# Altium schematic sheet adc.schdoc: SoRad: Analog to Digital Conversion
size A3; Author: Chris Hiszpanski
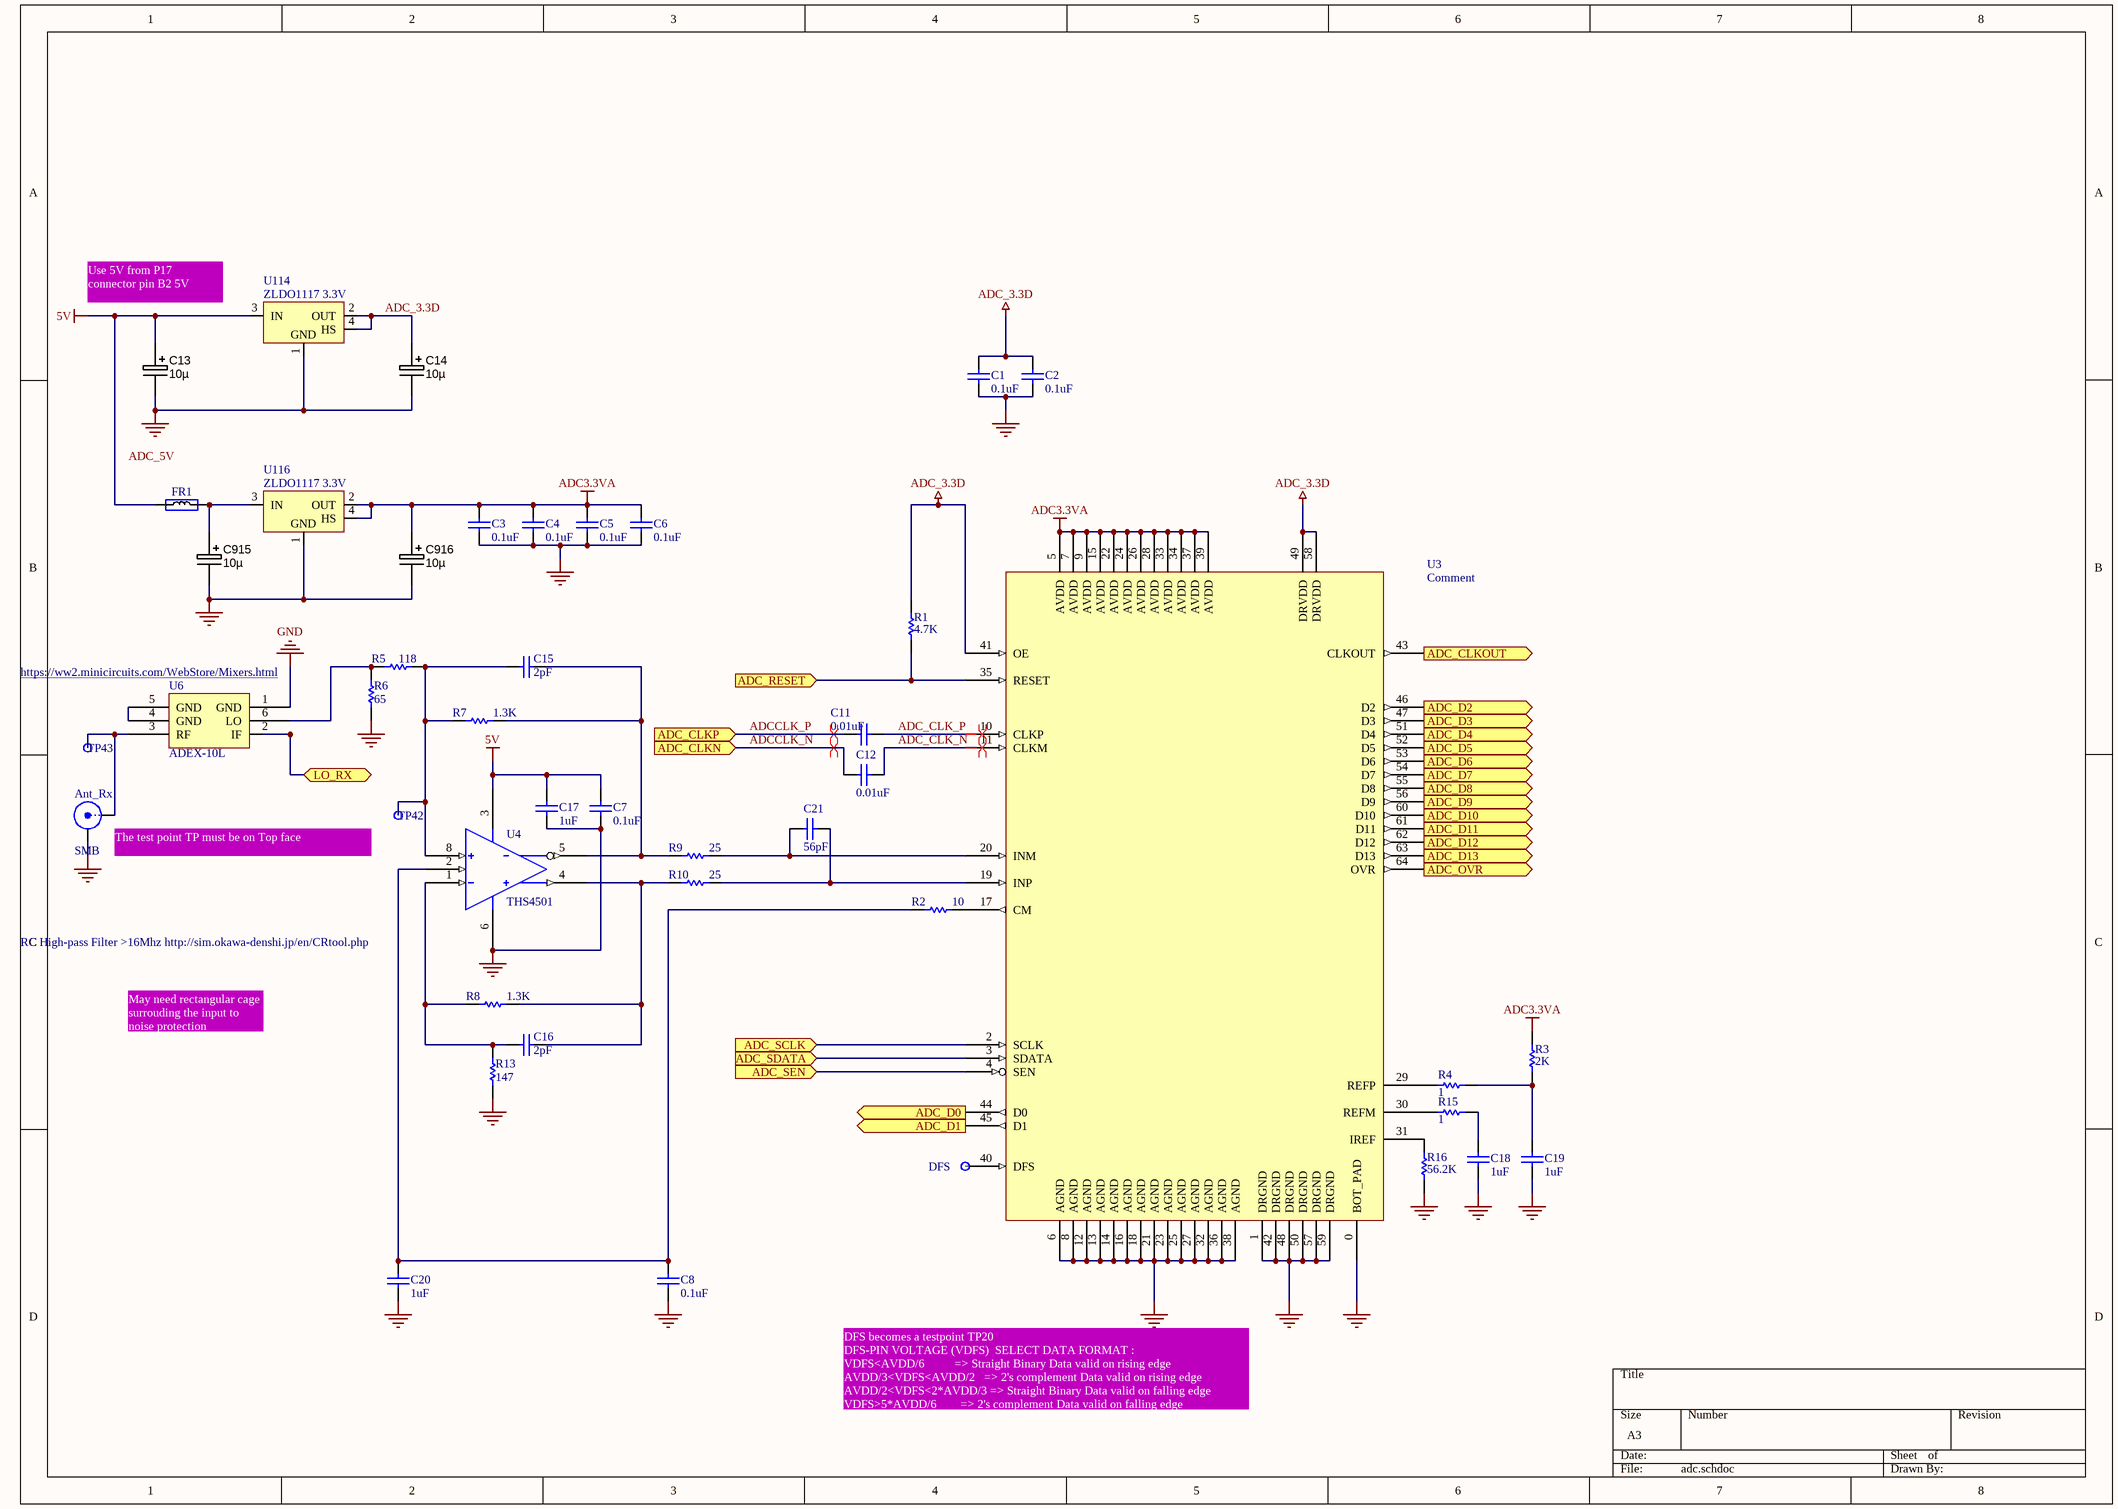
[diagram p0: adc.schdoc]

## Parts
Ant_Rx  SMB  [SMB_V-RJ45]
C1  0.1uF  [CAPC1005X55N]
C2  0.1uF  [CAPC1005X55N]
C3  0.1uF  [CAPC1005X55N]
C4  0.1uF  [CAPC1005X55N]
C5  0.1uF  [CAPC1005X55N]
C6  0.1uF  [CAPC1005X55N]
C7  0.1uF  [CAPC1005X55N]
C8  0.1uF  [CAPC1005X55N]
C11  0.01uF  [CAPC1005X55N]
C12  0.01uF  [CAPC1005X55N]
C13  value 10µ  [CAPMP6032X280N]  (hidden comment: approved sub OK)
C14  value 10µ  [CAPMP6032X280N]  (hidden comment: approved sub OK)
C15  2pF  [CAPC1005X55N]
C16  2pF  [CAPC1005X55N]
C17  1uF  [CAPC1005X55N]
C18  1uF  [CAPC1005X55N]
C19  1uF  [CAPC1005X55N]
C20  1uF  [CAPC1005X55N]
C21  56pF  [CAPC1005X55N]
C915  value 10µ  [CAPMP6032X280N]  (hidden comment: approved sub OK)
C916  value 10µ  [CAPMP6032X280N]  (hidden comment: approved sub OK)
DFS  P2V5  [TPS127]  (value not drawn)
FR1  Ferrite  [C0603]  (value not drawn)
R1  4.7K  [RESC1005N]
R2  10  [RESC1005N]
R3  2K  [RESC1005N]
R4  1  [RESC1005N]
R5  118  [RESC1005N]
R6  65  [RESC1005N]
R7  1.3K  [RESC1005N]
R8  1.3K  [RESC1005N]
R9  25  [RESC1005N]
R10  25  [RESC1005N]
R13  147  [RESC1005N]
R15  1  [RESC1005N]
R16  56.2K  [RESC1005N]
TP42  LO_RX  [TPS127]  (value not drawn)
TP43  LO_RX  [TPS127]  (value not drawn)
U3  Comment  [HQFP64]
U4  THS4501  [SOIC8]
U6  ADEX-10L
U114  ZLDO1117 3.3V  [SOT223]
U116  ZLDO1117 3.3V  [SOT223]

## Ports
ADC_CLKN (in), ADC_CLKOUT (out), ADC_CLKP (in), ADC_D0 (out), ADC_D1 (out), ADC_D2 (out), ADC_D3 (out), ADC_D4 (out), ADC_D5 (out), ADC_D6 (out), ADC_D7 (out), ADC_D8 (out), ADC_D9 (out), ADC_D10 (out), ADC_D11 (out), ADC_D12 (out), ADC_D13 (out), ADC_OVR (out), ADC_RESET (in), ADC_SCLK (in), ADC_SDATA (in), ADC_SEN (in), LO_RX

## Nets
5V: C7.2 C13.1 C17.2 FR1.1 U4.3(Vs+) U114.3(IN)
ADC3.3VA: C3.2 C4.2 C5.2 C6.2 C916.1 R3.1 U3.5(AVDD) U3.7(AVDD) U3.9(AVDD) U3.15(AVDD) U3.22(AVDD) U3.24(AVDD) U3.26(AVDD) U3.28(AVDD) U3.33(AVDD) U3.34(AVDD) U3.37(AVDD) U3.39(AVDD) U116.2(OUT) U116.4(HS)
ADC_3.3D: C1.2 C2.2 C14.1 R1.2 U3.41(OE) U3.49(DRVDD) U3.58(DRVDD) U114.2(OUT) U114.4(HS)
GND: Ant_Rx.2(Y) C1.1 C2.1 C3.1 C4.1 C5.1 C6.1 C7.1 C8.1 C13.2 C14.2 C17.1 C18.1 C19.1 C20.1 C915.2 C916.2 R6.2 R13.2 R16.2 U3.0(BOT_PAD) U3.1(DRGND) U3.6(AGND) U3.8(AGND) U3.12(AGND) U3.13(AGND) U3.14(AGND) U3.16(AGND) U3.18(AGND) U3.21(AGND) U3.23(AGND) U3.25(AGND) U3.27(AGND) U3.32(AGND) U3.36(AGND) U3.38(AGND) U3.42(DRGND) U3.48(DRGND) U3.50(DRGND) U3.57(DRGND) U3.59(DRGND) U4.6(Vs-) U6.1(GND) U114.1(GND) U116.1(GND)
ADC_CLK_N: C12.2 U3.11(CLKM)
ADC_CLK_P: C11.1 U3.10(CLKP)
ADC_CLKOUT: U3.43(CLKOUT) ; port ADC_CLKOUT
ADC_D0: U3.44(D0) ; port ADC_D0
ADC_D1: U3.45(D1) ; port ADC_D1
ADC_D2: U3.46(D2) ; port ADC_D2
ADC_D3: U3.47(D3) ; port ADC_D3
ADC_D4: U3.51(D4) ; port ADC_D4
ADC_D5: U3.52(D5) ; port ADC_D5
ADC_D6: U3.53(D6) ; port ADC_D6
ADC_D7: U3.54(D7) ; port ADC_D7
ADC_D8: U3.55(D8) ; port ADC_D8
ADC_D9: U3.56(D9) ; port ADC_D9
ADC_D10: U3.60(D10) ; port ADC_D10
ADC_D11: U3.61(D11) ; port ADC_D11
ADC_D12: U3.62(D12) ; port ADC_D12
ADC_D13: U3.63(D13) ; port ADC_D13
ADC_OVR: U3.64(OVR) ; port ADC_OVR
ADC_RESET: R1.1 U3.35(RESET) ; port ADC_RESET
ADC_SCLK: U3.2(SCLK) ; port ADC_SCLK
ADC_SDATA: U3.3(SDATA) ; port ADC_SDATA
ADC_SEN: U3.4(SEN) ; port ADC_SEN
ADCCLK_N: C12.1 ; port ADC_CLKN
ADCCLK_P: C11.2 ; port ADC_CLKP
LO_RX: U6.2(IF) ; port LO_RX
NetAnt_Rx_1: Ant_Rx.1(X) TP43.1 U6.3(RF)
NetC8_2: C8.2 C20.2 R2.2 U4.2(Vocm)
NetC15_1: C15.1 R7.1 R9.2 U4.5(Vout-)
NetC15_2: C15.2 R5.1 R7.2 TP42.1 U4.8(Vin+)
NetC16_1: C16.1 R8.1 R10.2 U4.4(Vout+)
NetC16_2: C16.2 R8.2 R13.1 U4.1(Vin-)
NetC18_2: C18.2 R15.2
NetC19_2: C19.2 R3.2 R4.2
NetC21_1: C21.1 R9.1 U3.20(INM)
NetC21_2: C21.2 R10.1 U3.19(INP)
NetC915_1: C915.1 FR1.2 U116.3(IN)
NetDFS_1: DFS.1 U3.40(DFS)
NetR2_1: R2.1 U3.17(CM)
NetR4_1: R4.1 U3.29(REFP)
NetR5_2: R5.2 R6.1 U6.6(LO)
NetR15_1: R15.1 U3.30(REFM)
NetR16_1: R16.1 U3.31(IREF)
NetU6_4: U6.4(GND) U6.5(GND)

## Layout directives
differential pair: ADC_CLK_N, ADC_CLK_P, ADCCLK_N, ADCCLK_P

## Notes on the sheet
- Use 5V from P17 connector pin B2 5V
- (near U6) https://ww2.minicircuits.com/WebStore/Mixers.html
- (near Ant_Rx) The test point TP must be on Top face
- (near U4) RC High-pass Filter >16Mhz http://sim.okawa-denshi.jp/en/CRtool.php
- May need rectangular cage surrouding the input to noise protection
- DFS becomes a testpoint TP20
  DFS-PIN VOLTAGE (VDFS)  SELECT DATA FORMAT :
  VDFS<AVDD/6          => Straight Binary Data valid on rising edge
  AVDD/3<VDFS<AVDD/2   => 2's complement Data valid on rising edge
  AVDD/2<VDFS<2*AVDD/3 => Straight Binary Data valid on falling edge
  VDFS>5*AVDD/6        => 2's complement Data valid on falling edge
- Labels drawn without touching a wire or pin: ADC_5V

## Library data of the parts
Ant_Rx = SMB: SMB Straight Connector; LatestRevisionDate: 17-Jul-2002; LatestRevisionNote: Re-released for DXP Platform.; Publisher: Altium Limited
C1-C8 = Cap: Capacitor; Manufacturer: Panasonic; Manufacturer Part Number: ECJ-2VF1C104Z; Published: 8-Jun-2000; Revision: July-2002: Re-released for DXP Platform.; Publisher: Altium Limited; Value: 0.1uF; Distributor: Digikey; Distributor Part Number: PCC1843CT-ND
C11 C12 = Cap: Capacitor; Manufacturer: Panasonic; Manufacturer Part Number: ECJ-2VF1H103Z; Published: 8-Jun-2000; Revision: July-2002: Re-released for DXP Platform.; Publisher: Altium Limited; Value: 0.01uF; Distributor: Digikey; Distributor Part Number: PCC1858CT-ND
C13 C14 C915 C916 = CAPT_10u_6032_16V: Capacitor SMD Tantalum 10uF 20% 16V EIA 6032-28; Manufacturer 1: Vishay/Sprague; Manufacturer Part Number 1: 293D106X0016C2TE3; SCDType: undef; Package / Case: EIA 6032-28; Tolerance: ±20%; Ratings: 16V; Material: Tantalum; Supplier 1: Digi-Key; Supplier Part Number 1: 718-1042-1-ND
C15 C16 = Cap: Capacitor; Manufacturer: Cornell Dubilier; Manufacturer Part Number: MC08CA020D-F; Published: 8-Jun-2000; Revision: July-2002: Re-released for DXP Platform.; Publisher: Altium Limited; Value: 2pF; Distributor: Digikey; Distributor Part Number: 338-1096-ND
C17-C20 = Cap: Capacitor; Manufacturer: Panasonic; Manufacturer Part Number: ECJ-2VF1C105Z; Published: 8-Jun-2000; Revision: July-2002: Re-released for DXP Platform.; Publisher: Altium Limited; Value: 1uF; Distributor: Digikey; Distributor Part Number: PCC1849CT-ND
C21 = Cap: Capacitor; Manufacturer: Yageo; Manufacturer Part Number: CC0805JRNP09BN560; Published: 8-Jun-2000; Revision: July-2002: Re-released for DXP Platform.; Publisher: Altium Limited; Value: 56pF; Distributor: Digikey; Distributor Part Number: 311-1108-1-ND
DFS TP42 TP43 = SMD_PAD_1.27X1.27MM: Test Point; Part Description: 1.27mm x 1.27mm PCB Copper Area (SMD Test Point); Mounted: No; Part Number: SMD_PAD_1.27X1.27MM; Component Kind: Standard (No BOM); Component Type: Standard (No BOM); Pin Count: 1; Family: Test Point; Socket: No; SMD: Yes; Sense: No; Status: None; ComponentHeight: 0mm; HelpURL: Undefined; Author: CERN DEM JLC; CreateDate: 12.01.2008; LatestRevisionDate: 12.01.2008; PackageDescription: 1.27mm x 1.27mm PCB Copper Area (SMD Test Point)
FR1 = Ferrite: Manufacturer Part Number 1: BK0603TS601-T; Manufacturer: Taiyo Yuden; Part Description: FERRITE BEAD 600 OHM 0201 1LN; DC Resistance (DCR): 750 mOhm Max; Filter Type: Differential Mode - Single; Impedance @ Frequency: 600 Ohm @ 100MHz; Current Rating: 270mA; Value: 600R@100MHz; Supplier 1: Digi-Key; Supplier Part Number 1: 587-3277-1-ND; Size / Dimension: 0.024" L x 0.012" W (0.60mm x 0.30mm); Package / Case: 0201 (0603 Metric); Height (Max): 0.013" (0.33mm); Mounting Type: Surface Mount; Packaging: Cut Tape (CT); RoHS: RoHS Compliant; Category: Filters
R1 = Res1: Resistor; Manufacturer: Generic Components; Manufacturer: Vishay/Dale; Manufacturer Part Number: CRCW08054K70JNEA; Class I: Passive; Published: 8-Jun-2000; Revision: July-2002: Re-released for DXP Platform.; Publisher: Altium Limited; Class II: Resistor; Value: 4.7K; Distributor: Digikey; Distributor Part Number: 541-4.7KACT-ND
R2 = Res1: Resistor; Manufacturer: Yageo; Manufacturer Part Number: RC0805FR-0710RL; Published: 8-Jun-2000; Revision: July-2002: Re-released for DXP Platform.; Publisher: Altium Limited; Value: 10; Distributor: Digikey; Distributor Part Number: 311-10.0CRCT-ND
R3 = Res1: Resistor; Manufacturer: Yageo; Manufacturer Part Number: RC0805FR-072KL; Published: 8-Jun-2000; Revision: July-2002: Re-released for DXP Platform.; Publisher: Altium Limited; Value: 2K; Distributor: Digikey; Distributor Part Number: 311-2.00KCRCT-ND
R4 R15 = Res1: Resistor; Manufacturer: Yageo; Manufacturer Part Number: RC0805FR-071RL; Published: 8-Jun-2000; Revision: July-2002: Re-released for DXP Platform.; Publisher: Altium Limited; Value: 1; Distributor: Digikey; Distributor Part Number: 311-1.00CRCT-ND
R5 = Res1: Resistor; Manufacturer: Yageo; Manufacturer Part Number: 9C08052A1180FKHFT; Published: 8-Jun-2000; Revision: July-2002: Re-released for DXP Platform.; Publisher: Altium Limited; Value: 118; Distributor: Digikey; Distributor Part Number: 311-118CCT-ND
R6 = Res1: Resistor; Manufacturer: Yageo; Manufacturer Part Number: 9C08052A64R9FKHFT; Published: 8-Jun-2000; Revision: July-2002: Re-released for DXP Platform.; Publisher: Altium Limited; Value: 65; Distributor: Digikey; Distributor Part Number: 311-64.9CCT-ND
R7 R8 = Res1: Resistor; Manufacturer: Rohm; Manufacturer Part Number: MCR10EZHF1301; Published: 8-Jun-2000; Revision: July-2002: Re-released for DXP Platform.; Publisher: Altium Limited; Value: 1.3K; Distributor: Digikey; Distributor Part Number: RHM1.30KCCT-ND
R9 R10 = Res1: Resistor; Manufacturer: Vishay/Dale; Manufacturer Part Number: CRCW080524R9FKEA; Published: 8-Jun-2000; Revision: July-2002: Re-released for DXP Platform.; Publisher: Altium Limited; Value: 25; Distributor: Digikey; Distributor Part Number: 541-24.9CCT-ND
R13 = Res1: Resistor; Manufacturer: Yageo; Manufacturer Part Number: RC0805FR-07147RL; Published: 8-Jun-2000; Revision: July-2002: Re-released for DXP Platform.; Publisher: Altium Limited; Value: 147; Distributor: Digikey; Distributor Part Number: 311-147CRCT-ND
R16 = Res1: Resistor; Manufacturer: Yageo; Manufacturer Part Number: RC0805FR-0756K2L; Published: 8-Jun-2000; Revision: July-2002: Re-released for DXP Platform.; Publisher: Altium Limited; Value: 56.2K; Distributor: Digikey; Distributor Part Number: 311-56.2KCRCT-ND
U3 = ADS5520: ADC 12BIT 125MSPS; Manufacturer: Texas Instruments; Manufacturer Part Number: ADS5520IPAP; Distributor: Digikey; Distributor Part Number: 296-17702-ND
U4 = THS4501: Differential Amplifier; Manufacturer: Texas Instruments; Manufacturer Part Number: THS4501ID; Distributor: Digikey; Distributor Part Number: 296-12936-5-ND
U6 = ADEX-10L: Passive Mixer
U114 = LM1117: Power
U116 = LM1117: Power; comment_1: LM1117MPX-3.3/NOPB